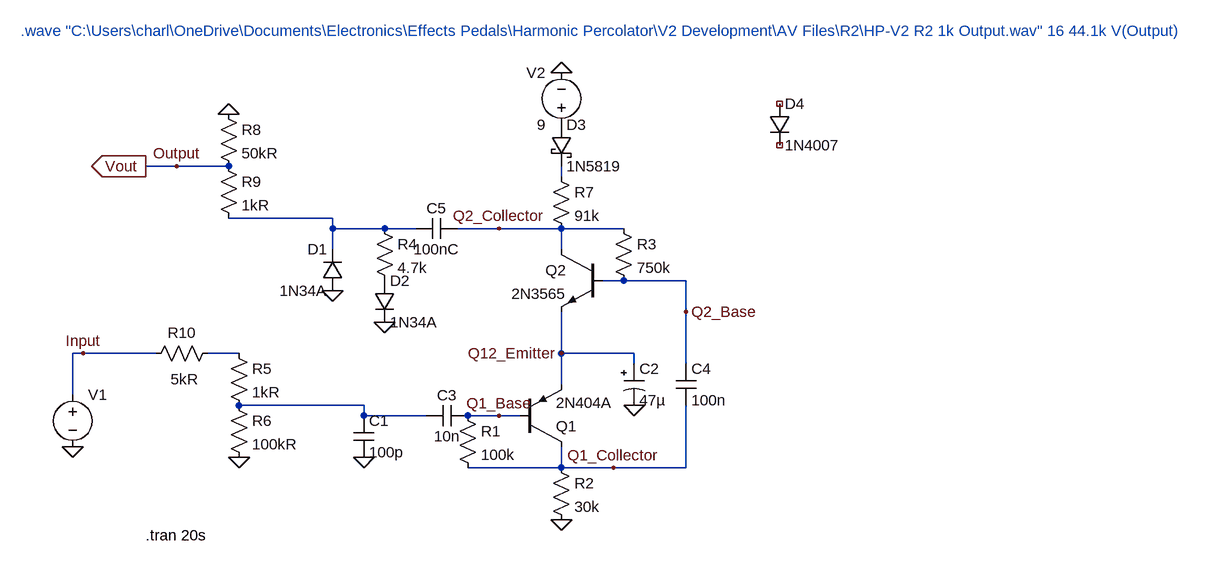
[diagram p0: schematic HarmonicPerculator.asc]
HarmonicPerculator.asc, the LTspice schematic file:
Version 4
SHEET 1 2164 680
WIRE 32 -208 -16 -208
WIRE 112 -208 32 -208
WIRE 624 -192 624 -208
WIRE 272 -128 112 -128
WIRE 272 -112 272 -128
WIRE 352 -112 272 -112
WIRE 400 -112 352 -112
WIRE 528 -112 464 -112
WIRE 624 -112 528 -112
WIRE 720 -112 624 -112
WIRE 272 -80 272 -112
WIRE 624 -80 624 -112
WIRE 720 -32 688 -32
WIRE 816 -32 720 -32
WIRE 816 16 816 -32
WIRE -112 80 -128 80
WIRE 0 80 -112 80
WIRE 128 80 80 80
WIRE 624 80 624 16
WIRE 736 80 624 80
WIRE 736 96 736 80
WIRE 816 96 816 16
WIRE 624 128 624 80
WIRE -128 144 -128 80
WIRE 320 160 128 160
WIRE 320 176 320 160
WIRE 416 176 320 176
WIRE 528 176 480 176
WIRE 560 176 528 176
WIRE 624 256 624 224
WIRE 624 256 480 256
WIRE 704 256 624 256
WIRE 816 256 816 160
WIRE 816 256 704 256
FLAG 320 240 0
FLAG 624 336 0
FLAG 736 160 0
FLAG 352 32 0
FLAG 272 -16 0
FLAG 624 -352 0
FLAG -16 -208 Vout
IOPIN -16 -208 Out
FLAG -128 224 0
FLAG -112 80 Input
FLAG 528 176 Q1_Base
FLAG 704 256 Q1_Collector
FLAG 624 80 Q12_Emitter
FLAG 32 -208 Output
FLAG 816 16 Q2_Base
FLAG 528 -112 Q2_Collector
FLAG 128 240 0
FLAG 112 -288 0
DATAFLAG -128 128 ""
SYMBOL cap 304 176 R0
SYMATTR InstName C1
SYMATTR Value 100p
SYMBOL cap 480 160 R90
WINDOW 0 0 32 VBottom 2
WINDOW 3 32 32 VTop 2
SYMATTR InstName C3
SYMATTR Value 10n
SYMBOL res 464 160 R0
SYMATTR InstName R1
SYMATTR Value 100k
SYMBOL res 608 240 R0
SYMATTR InstName R2
SYMATTR Value 30k
SYMBOL polcap 720 96 R0
SYMATTR InstName C2
SYMATTR Value 47µ
SYMBOL cap 800 96 R0
SYMATTR InstName C4
SYMATTR Value 100n
SYMBOL res 704 -128 R0
SYMATTR InstName R3
SYMATTR Value 750k
SYMBOL voltage 624 -256 R180
WINDOW 0 24 96 Left 2
WINDOW 3 24 16 Left 2
WINDOW 123 0 0 Left 0
WINDOW 39 0 0 Left 0
SYMATTR InstName V2
SYMATTR Value 9
SYMBOL diode 288 -16 R180
WINDOW 0 24 64 Left 2
WINDOW 3 24 0 Left 2
SYMATTR InstName D1
SYMATTR Value 1N34A
SYMBOL res 336 -128 R0
SYMATTR InstName R4
SYMATTR Value 4.7k
SYMBOL diode 336 -32 R0
SYMATTR InstName D2
SYMATTR Value 1N34A
SYMBOL voltage -128 128 R0
WINDOW 3 24 96 Invisible 2
SYMATTR Value wavefile="GTR CLEAN 15S 2.wav"
SYMATTR InstName V1
SYMBOL res 608 -208 R0
SYMATTR InstName R7
SYMATTR Value 91k
SYMBOL npn 688 -80 M0
SYMATTR InstName Q2
SYMATTR Value 2N3565
SYMBOL schottky 608 -272 R0
SYMATTR InstName D3
SYMATTR Value 1N5819
SYMATTR Description Diode
SYMATTR Type diode
SYMBOL diode 944 -304 R0
SYMATTR InstName D4
SYMATTR Value 1N4007
SYMBOL pnp 560 224 M180
SYMATTR InstName Q1
SYMATTR Value 2N404A
SYMBOL cap 464 -128 R90
WINDOW 0 0 32 VBottom 2
WINDOW 3 32 32 VTop 2
SYMATTR InstName C5
SYMATTR Value 100nC
SYMBOL res 112 64 R0
SYMATTR InstName R5
SYMATTR Value 1kR
SYMBOL res 112 144 R0
SYMATTR InstName R6
SYMATTR Value 100kR
SYMBOL res 96 -304 R0
SYMATTR InstName R8
SYMATTR Value 50kR
SYMBOL res 96 -224 R0
SYMATTR InstName R9
SYMATTR Value 1kR
SYMBOL res 96 64 R90
WINDOW 0 0 56 VBottom 2
WINDOW 3 40 52 VTop 2
SYMATTR InstName R10
SYMATTR Value 5kR
TEXT -16 360 Left 2 !.tran 20s
TEXT -208 -416 Left 2 ;.wave "C:\\Users\\charl\\OneDrive\\Documents\\Electronics\\Effects Pedals\\Harmonic Percolator\\V2 Development\\AV Files\\R2\\HP-V2 R2 1k Output.wav" 16 44.1k V(Output)

The netlist it stands for:
* HarmonicPerculator.asc
C1 N004 0 100p
C3 Q1_Base N004 10n
R1 Q1_Base Q1_Collector 100k
R2 Q1_Collector 0 30k
C2 Q12_Emitter 0 47µ
C4 Q2_Base Q1_Collector 100n
R3 Q2_Collector Q2_Base 750k
V2 P001 0 9
D1 0 N002 1N34A
R4 N002 P002 4.7k
D2 P002 0 1N34A
V1 Input 0 wavefile="GTR CLEAN 15S 2.wav"
R7 N001 Q2_Collector 91k
Q2 Q2_Collector Q2_Base Q12_Emitter 0 2N3565
D3 P001 N001 1N5819
D4 NC_01 NC_02 1N4007
Q1 Q1_Collector Q1_Base Q12_Emitter 0 2N404A
C5 Q2_Collector N002 100nC
R5 N003 N004 1kR
R6 N004 0 100kR
R8 0 Output 50kR
R9 Output N002 1kR
R10 N003 Input 5kR
.model D D
.lib standard.dio
.model NPN NPN
.model PNP PNP
.lib standard.bjt
.tran 20s
* .wave "C:\Users\charl\OneDrive\Documents\Electronics\Effects Pedals\Harmonic Percolator\V2 Development\AV Files\R2\HP-V2 R2 1k Output.wav" 16 44.1k V(Output)
.backanno
.end